# EAGLE design charlyplex badge (EAGLE 6.5.0)
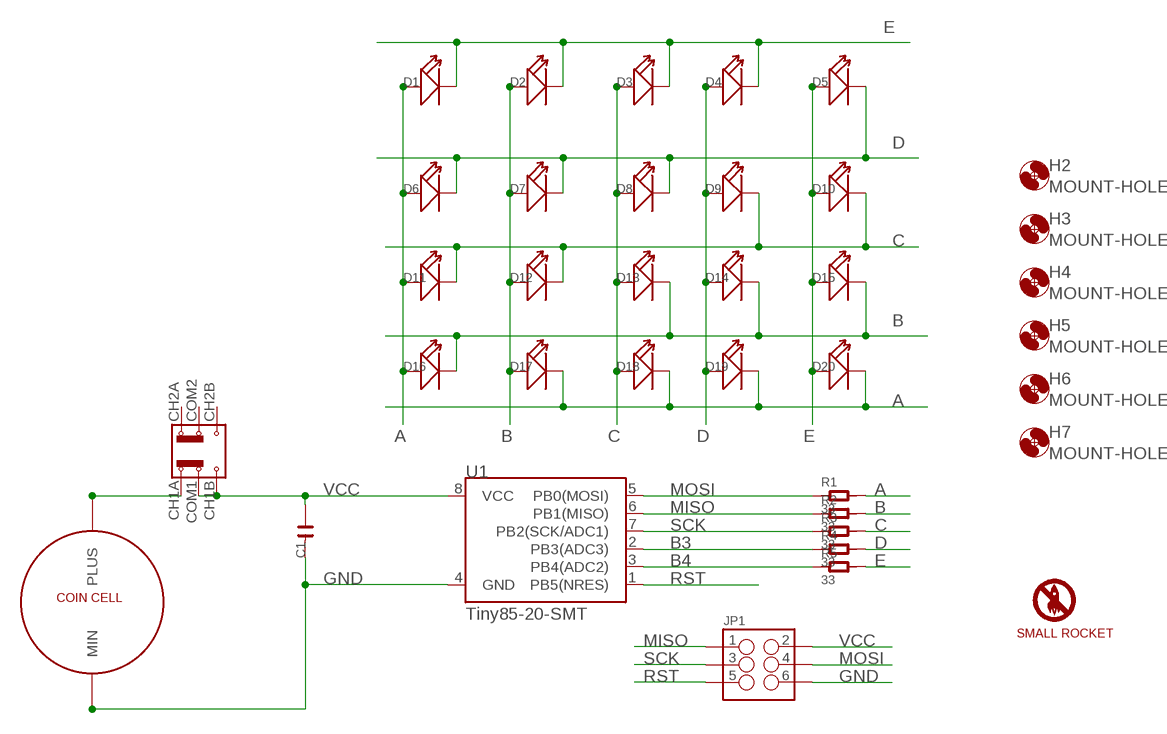
[diagram p0: schematic, sheet 1]

## Parts
C1  C-0603  [C0603]
D1  LED  [LED0603]
D2  LED  [LED0603]
D3  LED  [LED0603]
D4  LED  [LED0603]
D5  LED  [LED0603]
D6  LED  [LED0603]
D7  LED  [LED0603]
D8  LED  [LED0603]
D9  LED  [LED0603]
D10  LED  [LED0603]
D11  LED  [LED0603]
D12  LED  [LED0603]
D13  LED  [LED0603]
D14  LED  [LED0603]
D15  LED  [LED0603]
D16  LED  [LED0603]
D17  LED  [LED0603]
D18  LED  [LED0603]
D19  LED  [LED0603]
D20  LED  [LED0603]
H2  MOUNT-HOLE  [3.2-NOMARKINGS-SMALLSAFEZONE]
H3  MOUNT-HOLE  [3.2-NOMARKINGS-SMALLSAFEZONE]
H4  MOUNT-HOLE  [3.2-NOMARKINGS-SMALLSAFEZONE]
H5  MOUNT-HOLE  [3.2-NOMARKINGS-SMALLSAFEZONE]
H6  MOUNT-HOLE  [3.2-NOMARKINGS-SMALLSAFEZONE]
H7  MOUNT-HOLE  [3.2-NOMARKINGS-SMALLSAFEZONE]
JP1  M03X2SMT  [2X3_SMT_POSTS]
R1  33  R-0603  [R0603]
R2  33  R-0603  [R0603]
R3  33  R-0603  [R0603]
R4  33  R-0603  [R0603]
R5  33  R-0603  [R0603]
SW1  SWITCH-2CH-6P-3010010P1  [6P-2CH-2.54-9.1X3.5X3.2+2H]
U1  Tiny85-20-SMT  ATTINY45TINY85-20-SMT  [SO08-EIAJ]
U$1  COINCELL  [2032HOLDER-SZ]
U$2  SMALLROCKET  [SMALLROCKET]

## Nets
A: D1.+ D6.+ D11.+ D16.+ D17.- D18.- D19.- D20.- R1.2
B: D2.+ D7.+ D12.+ D13.- D14.- D15.- D16.- D17.+ R2.2
B3: R4.1 U1.2(PB3(ADC3))
B4: R5.1 U1.3(PB4(ADC2))
C: D3.+ D8.+ D9.- D10.- D11.- D12.- D13.+ D18.+ R3.2
D: D4.+ D5.- D6.- D7.- D8.- D9.+ D14.+ D19.+ R4.2
E: D1.- D2.- D3.- D4.- D5.+ D10.+ D15.+ D20.+ R5.2
GND: C1.1 JP1.6 U1.4(GND) U$1.MIN
MISO: JP1.1 R2.1 U1.6(PB1(MISO))
MOSI: JP1.4 R1.1 U1.5(PB0(MOSI))
N$8: SW1.CH1A U$1.PLUS
RST: JP1.5 U1.1(PB5(NRES))
SCK: JP1.3 R3.1 U1.7(PB2(SCK/ADC1))
VCC: C1.2 JP1.2 SW1.CH1B SW1.COM1 U1.8(VCC)
Unconnected: SW1.CH2A SW1.CH2B SW1.COM2

## Library data of the parts
C1 = OPL:C*
D1-D20 = OPL:LED*: LED
H2-H7 = zephod-components:MOUNT-HOLE: MOUNTING HOLE with drill center marker
JP1 = zephod-components:M03X2: 2x3 .1" header. Shrouded, with keying- CONN-10681 SMT- CONN-11415 Pogo pins- HW-11044; PROD_ID: CONN-11415
R1-R5 = OPL:R*
SW1 = OPL:SWITCH-2CH-6P*: MS-22D18 G2 ROHS
U1 = SparkFun-DigitalIC:ATTINY45: Atmel 8-pin 2/4/8kB flash uC; PROD_ID: IC-09092
U$1 = BatteryHolder:COINCELL
U$2 = zephod-components:SMALLROCKET

## Net classes
0 default: width 0.381 mm

## Board
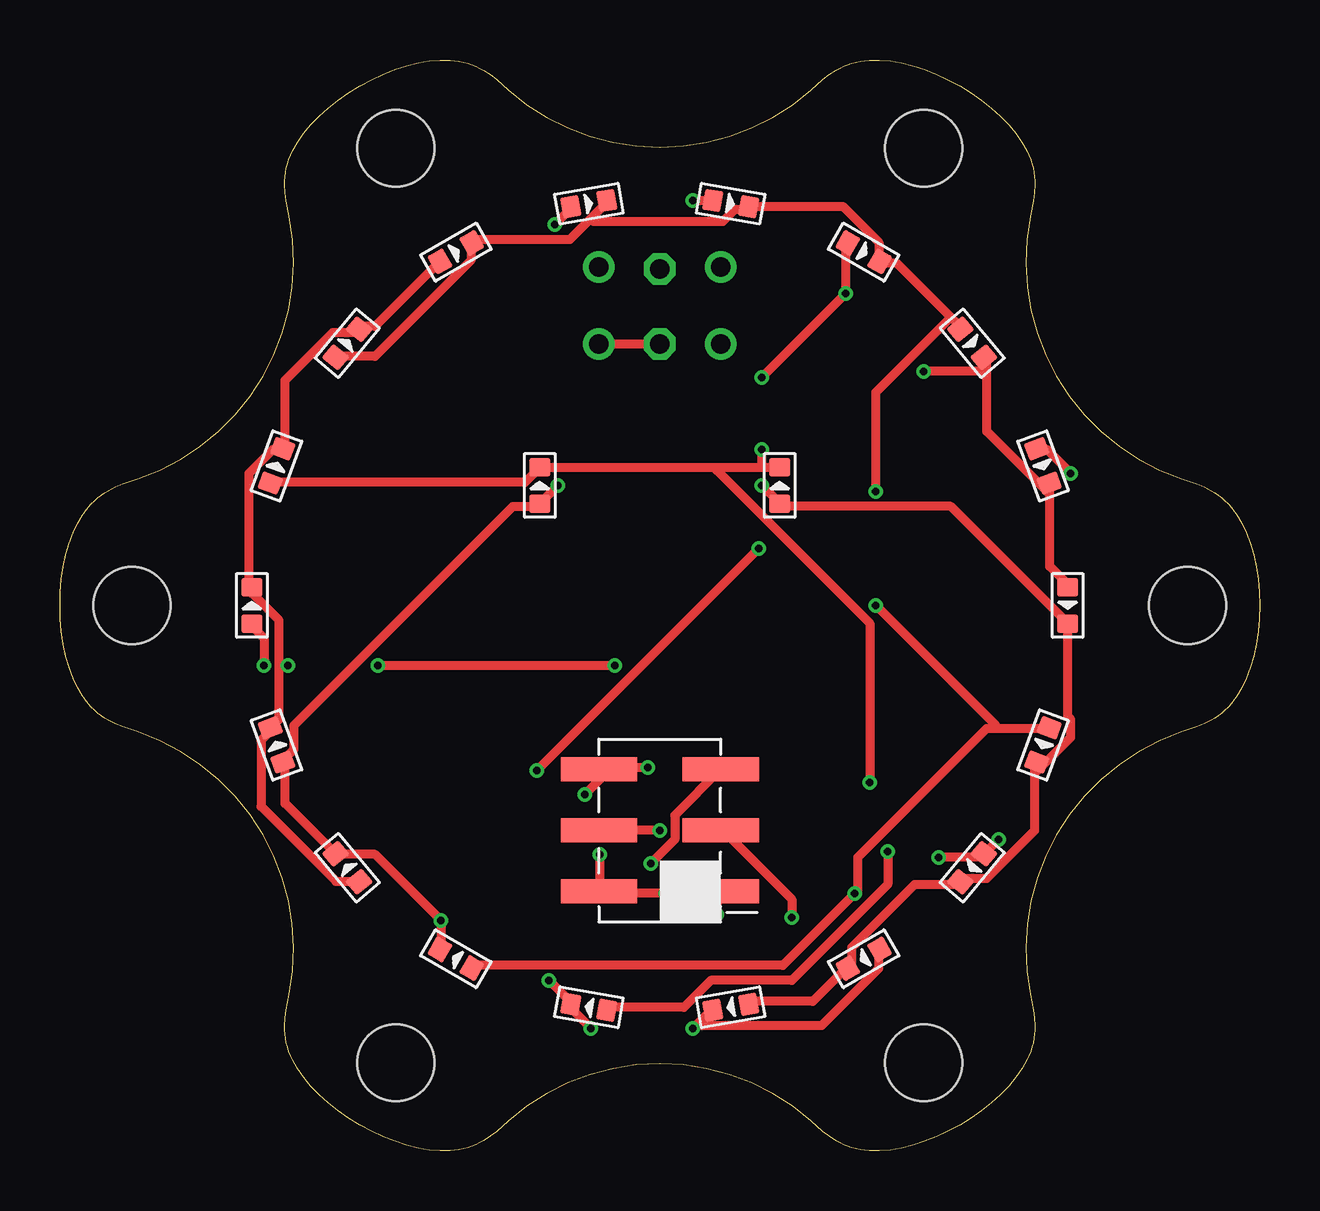
[diagram p1: board, top side]
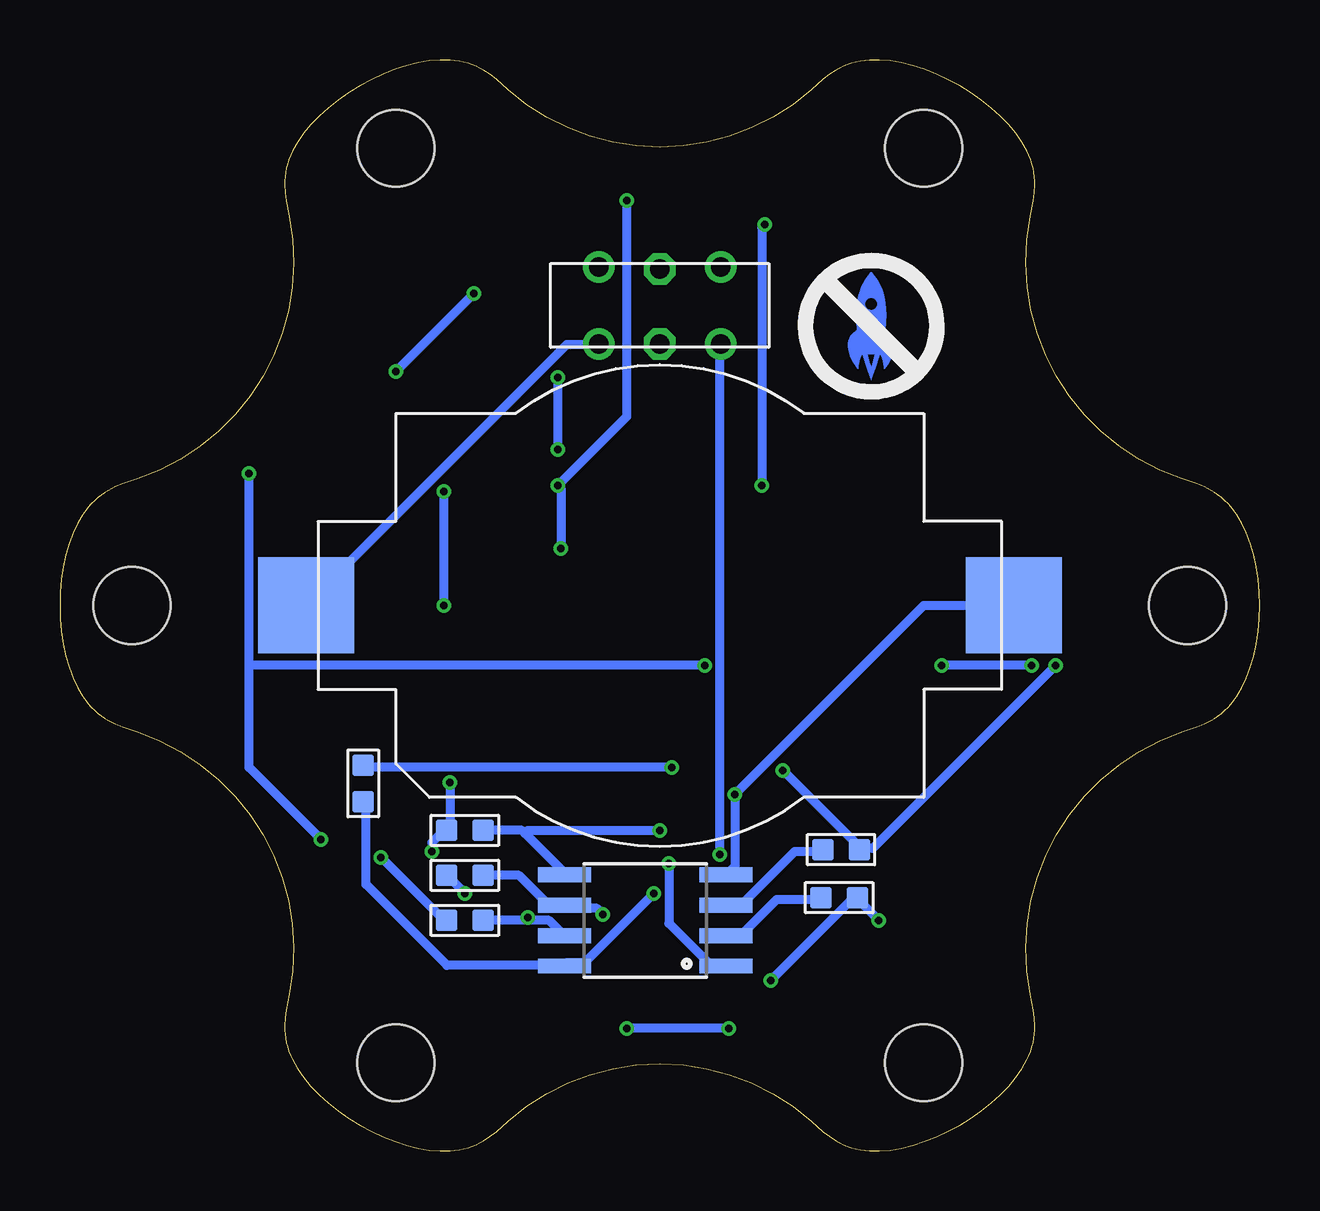
[diagram p2: board, bottom side, seen from below]

Size 50 x 45.45 mm. Coordinates in mm from the lower left corner, seen from the top.
Outline: 18.68,44.21 19.46,43.6 20.29,43.07 21.17,42.62 22.09,42.28 23.04,42.03 24.02,41.87 25,41.82 25.98,41.87 26.96,42.03 27.91,42.28 28.83,42.62 29.71,43.07 30.54,43.6 31.32,44.21 31.81,44.65 32.07,44.85 32.35,45.04 32.5,45.12 32.66,45.19 32.82,45.26 32.99,45.32 33.17,45.36 33.36,45.4 33.55,45.43 33.75,45.45 34.17,45.45 34.61,45.42 35.07,45.34 35.55,45.22 36.04,45.06 36.53,44.87 37.02,44.64 37.5,44.38 37.97,44.09 38.41,43.78 38.82,43.45 39.2,43.11 39.55,42.76 39.85,42.39 40.1,42.03 40.3,41.66 40.39,41.48 40.46,41.3 40.52,41.12 40.56,40.94 40.6,40.77 40.62,40.59 40.64,40.42 40.64,40.25 40.62,39.91 40.58,39.58 40.45,38.94 40.3,37.96 40.26,36.98 40.32,35.99 40.48,35.02 40.73,34.07 41.09,33.15 41.54,32.27 42.07,31.45 42.69,30.68 43.39,29.98 44.15,29.36 44.97,28.82 45.84,28.36 46.76,28 47.39,27.79 47.7,27.67 48,27.51 48.14,27.42 48.28,27.33 48.42,27.22 48.56,27.1 48.69,26.97 48.81,26.83 48.94,26.68 49.05,26.51 49.27,26.15 49.45,25.75 49.62,25.31 49.75,24.84 49.86,24.34 49.94,23.81 49.98,23.27 50,22.73 49.98,22.18 49.94,21.64 49.86,21.12 49.75,20.62 49.62,20.14 49.45,19.7 49.27,19.3 49.05,18.94 48.94,18.78 48.81,18.63 48.69,18.49 48.56,18.36 48.42,18.24 48.28,18.13 48.14,18.03 48,17.94 47.7,17.79 47.39,17.67 46.76,17.46 45.84,17.09 44.97,16.64 44.15,16.1 43.39,15.47 42.69,14.77 42.07,14.01 41.54,13.18 41.09,12.3 40.73,11.38 40.48,10.43 40.32,9.46 40.26,8.48 40.3,7.49 40.45,6.52 40.58,5.87 40.62,5.54 40.64,5.21 40.64,5.03 40.62,4.86 40.6,4.69 40.56,4.51 40.52,4.33 40.46,4.15 40.39,3.97 40.3,3.79 40.1,3.43 39.85,3.06 39.55,2.7 39.2,2.34 38.82,2 38.41,1.67 37.97,1.36 37.5,1.08 37.02,0.82 36.53,0.59 36.04,0.39 35.55,0.23 35.07,0.12 34.61,0.04 34.17,0 33.75,0.01 33.55,0.02 33.36,0.05 33.17,0.09 32.99,0.14 32.82,0.2 32.66,0.26 32.5,0.34 32.35,0.42 32.07,0.6 31.81,0.81 31.32,1.25 30.54,1.86 29.71,2.39 28.83,2.83 27.91,3.18 26.96,3.43 25.98,3.58 25,3.63 24.02,3.58 23.04,3.43 22.09,3.18 21.17,2.83 20.29,2.39 19.46,1.86 18.68,1.25 18.19,0.81 17.93,0.6 17.65,0.42 17.5,0.34 17.34,0.26 17.18,0.2 17.01,0.14 16.83,0.09 16.64,0.05 16.45,0.02 16.25,0.01 15.83,0 15.39,0.04 14.93,0.12 14.45,0.23 13.96,0.39 13.47,0.59 12.98,0.82 12.5,1.08 12.04,1.36 11.59,1.67 11.18,2 10.79,2.34 10.45,2.7 10.15,3.06 9.9,3.43 9.7,3.79 9.61,3.97 9.54,4.15 9.48,4.33 9.44,4.51 9.4,4.69 9.38,4.86 9.36,5.03 9.36,5.21 9.38,5.54 9.42,5.87 9.55,6.52 9.7,7.49 9.74,8.48 9.68,9.46 9.53,10.43 9.27,11.38 8.91,12.3 8.46,13.18 7.93,14.01 7.31,14.77 6.61,15.47 5.85,16.1 5.03,16.64 4.16,17.09 3.24,17.46 2.61,17.67 2.3,17.79 2,17.94 1.86,18.03 1.72,18.13 1.58,18.24 1.44,18.36 1.31,18.49 1.18,18.63 1.06,18.78 0.95,18.94 0.73,19.3 0.55,19.7 0.38,20.14 0.25,20.62 0.14,21.12 0.06,21.64 0.02,22.18 0,22.73 0.02,23.27 0.06,23.81 0.14,24.34 0.25,24.84 0.38,25.31 0.55,25.75 0.73,26.15 0.95,26.51 1.06,26.68 1.18,26.83 1.31,26.97 1.44,27.1 1.58,27.22 1.72,27.33 1.86,27.42 2,27.51 2.3,27.67 2.61,27.79 3.24,28 4.16,28.36 5.03,28.82 5.85,29.36 6.61,29.98 7.31,30.68 7.93,31.45 8.46,32.27 8.91,33.15 9.27,34.07 9.53,35.02 9.68,35.99 9.74,36.98 9.7,37.96 9.55,38.94 9.42,39.58 9.38,39.91 9.36,40.25 9.36,40.42 9.38,40.59 9.4,40.77 9.44,40.94 9.48,41.12 9.54,41.3 9.61,41.48 9.7,41.66 9.9,42.03 10.15,42.39 10.45,42.76 10.79,43.11 11.18,43.45 11.59,43.78 12.04,44.09 12.5,44.38 12.98,44.64 13.47,44.87 13.96,45.06 14.45,45.22 14.93,45.34 15.39,45.42 15.83,45.45 16.25,45.45 16.45,45.43 16.64,45.4 16.83,45.36 17.01,45.32 17.18,45.26 17.34,45.19 17.5,45.12 17.65,45.04 17.93,44.85 18.19,44.65 18.68,44.21
Copper layers (1*16): Top 0.035mm / dielectric 1.5mm / Bottom 0.035mm
Design rules "dirt_cheap_dirty_boards.v1": minimum track width 5mil, minimum drill 12mil, track to track 5mil, track to pad 5mil, pad to pad 5mil, via to via 5mil, smd to smd 0mil, copper to edge 10mil, drill to drill 10mil, minimum pad ring 10mil, minimum via ring 6mil, stop-mask expansion 2mil, vias tented up to drill 25mil, thermal gap 10mil

### Footprints (pad centres in the part's own frame; a part is rotated, then mirrored left to right if it is on the bottom)
C0603 = smd 0.889 x 0.889: 1 -0.762,0; 2 0.762,0
LED0603 = smd 0.762 x 0.889: + -0.762,0; - 0.762,0
3.2-NOMARKINGS-SMALLSAFEZONE = hole 3.2: 0,0
2X3_SMT_POSTS = smd 1 x 3.17: 1 -2.54,-2.54; 2 -2.54,2.54; 3 0,-2.54; 4 0,2.54; 5 2.54,-2.54; 6 2.54,2.54
R0603 = smd 0.889 x 0.889: 1 -0.762,0; 2 0.762,0
6P-2CH-2.54-9.1X3.5X3.2+2H = drill 0.813 pad 1.27: CH1A -2.54,-1.6; CH1B 2.54,-1.6; CH2A -2.54,1.6; CH2B 2.54,1.6 | drill 0.813 pad 1.27 octagon: COM1 0,-1.6; COM2 0,1.524
SO08-EIAJ = smd 0.61 x 2.21: 1 -1.905,-3.378; 2 -0.635,-3.378; 3 0.635,-3.378; 4 1.905,-3.378; 5 1.905,3.353; 6 0.635,3.353; 7 -0.635,3.353; 8 -1.905,3.353
2032HOLDER-SZ = smd 4 x 4: MIN 0,-14.75; PLUS 0,14.75

### Placement (x,y rotation side)
C1  37.36,15.32 270 bottom
D1  42,22.73 270 top
D2  40.97,16.91 250 top
D3  38.02,11.8 230 top
D4  33.5,8 210 top
D5  27.95,5.99 190 top
D6  22.05,5.99 170 top
D7  16.5,8 150 top
D8  11.98,11.8 130 top
D9  9.03,16.91 110 top
D10  8,22.73 90 top
D11  9.03,28.54 70 top
D12  11.98,33.65 50 top
D13  16.5,37.45 30 top
D14  22.05,39.47 10 top
D15  27.95,39.47 350 top
D16  33.5,37.45 330 top
D17  38.02,33.65 310 top
D18  40.97,28.54 290 top
D19  20,27.73 90 top
D20  30,27.73 90 top
H2  3,22.73 0 top
H3  47,22.73 0 top
H4  14,41.78 0 top
H5  36,41.78 0 top
H6  14,3.68 0 top
H7  36,3.68 0 top
JP1  25,13.35 90 top
R1  33.12,13.35 180 bottom
R2  33.12,11.48 180 bottom
R3  33.12,9.6 180 bottom
R4  17.52,10.56 0 bottom
R5  17.44,12.56 0 bottom
SW1  25,35.23 0 bottom
U1  25.62,9.6 90 bottom
U$1  25,22.73 90 bottom
U$2  16.49,34.06 0 bottom

### Tracks (layer width: path | path; a pad name or v marks a point on that pad's centre or on a via)
A  (via drill 0.3)
  Top 0.381: D1.+ 42,23.6 41.25,24.35 41.25,27.73 D18.- 41.12,27.48 38.62,29.98 38.62,32.48 | 38.62,32.48 38.62,32.98 D17.- | 38.62,32.48 v36,32.48 | D16.+ 32.75,37.73 v32.75,35.73 v29.25,32.23 | v34.5,12.48 34.5,11.1 30.5,7.1 27.12,7.1 26,5.98 22.88,5.98 D6.+ | D11.+ 8.88,27.85 19.38,27.85 D19.- 20.12,28.48 27.38,28.48 | 27.38,28.48 29.25,28.48 | 29.25,28.48 D20.- | v33.75,15.35 33.75,21.98 27.38,28.35 27.38,28.48 | 29.25,28.48 v29.25,29.23
  Bottom 0.381: v36,32.48 v32.75,35.73 | v34.5,12.48 34.5,12.85 34,13.35 R1.2 33.75,13.48 v33.75,15.35 | v29.25,29.23 v29.25,32.23
B  (via drill 0.3)
  Top 0.381: 37.12,34.73 37.5,34.35 D17.+ | 37.12,34.73 34.88,36.98 34.25,36.98 D16.- 34.12,37.23 34.12,37.85 32.62,39.35 28.88,39.35 D15.- 28.62,39.23 28.12,39.23 27.62,38.73 22.25,38.73 22.12,38.85 | D12.+ 11.5,33.1 13.12,33.1 17.12,37.1 17.12,37.73 D13.- 17.25,37.98 21.25,37.98 22.12,38.85 | 22.12,38.85 22.75,39.48 D14.- | D7.+ 17.25,7.73 30.12,7.73 v33.12,10.73 33.25,10.85 33.25,12.23 38.62,17.6 39,17.6 | 39,17.6 41.12,17.6 D2.+ | 37.12,34.73 34,31.6 v34,27.48 | v34,22.73 39,17.73 39,17.6
  Bottom 0.381: v33.12,10.73 33.88,11.48 R2.2 | v34,22.73 v34,27.48
B3
  Bottom 0.381: R4.1 18.38,10.48 20.12,10.48 21.62,8.98 22.12,8.98 U1.2
B4
  Bottom 0.381: R5.1 18.25,12.48 19.38,12.48 21.5,10.35 22.12,10.35 U1.3
C  (via drill 0.3)
  Top 0.381: v36.62,12.23 38.38,12.23 38.5,12.35 D3.+ 38.62,12.48 v39.12,12.98 | v42.12,28.23 41.12,29.23 40.75,29.23 D18.+ | D13.+ 15.75,36.98 13.12,34.35 12.5,34.35 D12.- 12.38,34.1 11.38,34.1 9.38,32.1 9.38,29.35 D11.- 9.25,29.23 8.88,29.23 7.88,28.23 7.88,23.6 D10.- 8,23.23 9.12,22.1 9.12,20.23 | 9.12,20.23 9.12,17.98 8.88,17.73 D9.- 8.75,17.48 8.38,17.1 8.38,14.35 11.5,11.23 12.38,11.23 D8.+ | v13.25,20.23 v23.12,20.23 | 9.12,20.23 v9.5,20.23
  Bottom 0.381: v36.62,12.23 34,9.6 R3.2 | 42.12,20.23 42.12,15.98 v39.12,12.98 | 42.12,20.23 v42.12,28.23 | v23.12,20.23 42.12,20.23 | v9.5,20.23 v13.25,20.23
D  (via drill 0.3)
  Top 0.381: v20.75,27.73 D19.+ 19.88,26.85 18.88,26.85 9.75,17.73 9.75,16.73 9.38,16.35 D9.+ 9.38,16.1 9.38,14.48 11.38,12.48 D8.- 11.62,12.35 13.12,12.35 v15.88,9.6 15.88,8.48 D7.- | v20.62,38.6 21.25,39.23 D14.+ | v20.38,7.1 21.25,6.23 D6.- 21.25,5.98 v22.12,5.1 | v26.38,5.1 26.62,5.35 | 26.62,5.35 27.12,5.85 D5.- | D4.+ 34.12,8.35 34.12,7.6 31.75,5.23 26.75,5.23 26.62,5.35
  Bottom 0.381: v20.75,27.73 20.75,38.48 v20.62,38.6 | v15.88,9.6 16.75,10.48 R4.2 16.88,10.6 v20.38,7.1 | v22.12,5.1 v26.38,5.1
E  (via drill 0.3)
  Top 0.381: v8.5,20.23 8.5,21.35 8,21.85 D10.+ | D5.+ 28.75,6.23 31.38,6.23 32.75,7.6 D4.- 33,7.73 33,8.48 35.62,11.1 37.5,11.1 D3.- 37.62,11.35 38.62,11.35 40.62,13.35 40.62,16.1 D2.- 40.75,15.85 42.12,17.23 42.12,17.98 42,18.1 D1.- 41.88,22.1 37.12,26.85 30,26.85 D20.+ 29.88,27.1 v29.25,27.73 | v26.38,39.6 27.12,39.6 D15.+ | v29.12,25.1 v19.88,15.85
  Bottom 0.381: v8.5,20.23 16.12,12.6 16.62,12.6 R5.2 16.75,12.73 v19.88,15.85 | v26.38,39.6 26.38,30.6 v29.25,27.73 29.12,27.6 v29.12,25.1
GND  (via drill 0.3)
  Top 0.381: v24.5,15.98 22.5,15.98 JP1.6 22.88,15.85 v21.88,14.85
  Bottom 0.381: v24.5,15.98 37.25,15.98 C1.1 | U1.4 22.12,11.6 21.88,11.85 v21.88,14.85 14,22.73 U$1.MIN
MISO  (via drill 0.3)
  Top 0.381: v27.38,9.85 27.38,10.6 27.5,10.73 JP1.1
  Bottom 0.381: R2.1 30.88,11.48 29.75,10.35 29,10.35 U1.6 28.88,10.1 27.62,10.1 v27.38,9.85
MOSI  (via drill 0.3)
  Top 0.381: v25,13.35 JP1.4
  Bottom 0.381: R1.1 30.75,13.35 30.62,13.23 | 30.62,13.23 29,11.6 U1.5 | v25,13.35 30.5,13.35 30.62,13.23
N$8
  Bottom 0.381: U$1.PLUS 28.88,33.6 27.62,33.6 SW1.CH1A
RST  (via drill 0.3)
  Top 0.381: v24.62,11.98 25.62,12.98 25.62,13.98 JP1.5
  Bottom 0.381: v24.62,11.98 24.62,9.48 22.88,7.73 22.25,7.73 U1.1
SCK  (via drill 0.3)
  Top 0.381: v30.5,9.73 30.5,10.48 27.62,13.35 JP1.3
  Bottom 0.381: 30.5,9.6 29.62,9.6 29,8.98 U1.7 | 30.5,9.6 R3.1 | v30.5,9.73 30.5,9.6
VCC  (via drill 0.3)
  Top 0.381: SW1.CH1B 22.5,33.6 25,33.6 SW1.COM1 | v25.25,10.73 22.5,10.73 JP1.2 22.5,10.98 v22.5,12.35
  Bottom 0.381: C1.2 37.25,14.48 37.25,11.1 33.88,7.73 29,7.73 U1.8 28.88,7.85 28.12,7.85 v25.25,10.73 | v22.5,12.35 22.5,33.6 SW1.CH1B